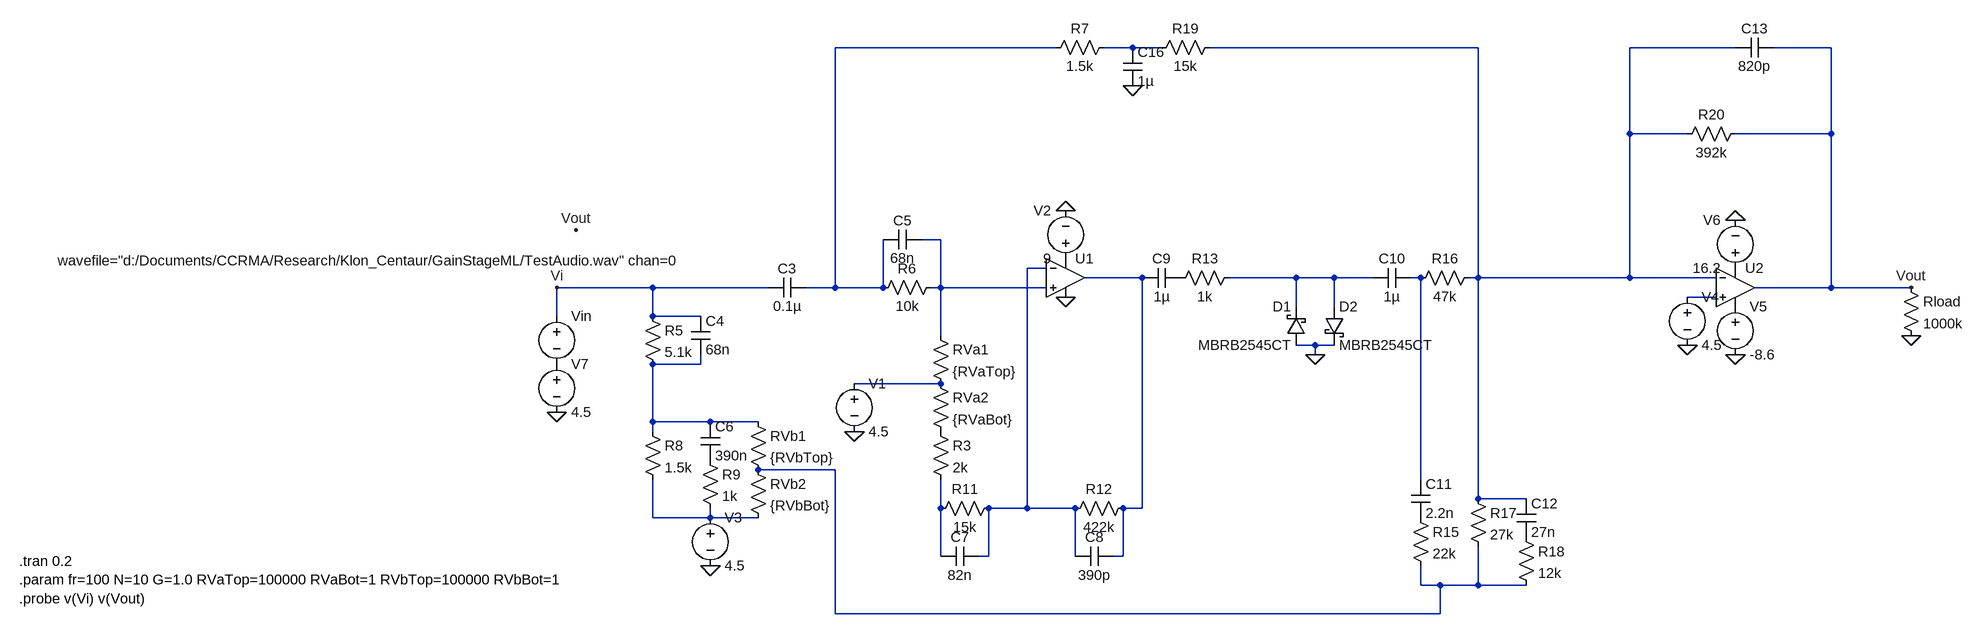
[diagram p0: schematic GainStage2.asc]
GainStage2.asc, the LTspice schematic file:
Version 4
SHEET 1 2608 680
WIRE 800 -304 432 -304
WIRE 928 -304 880 -304
WIRE 976 -304 928 -304
WIRE 1504 -304 1056 -304
WIRE 2144 -304 1968 -304
WIRE 2304 -304 2208 -304
WIRE 1968 -160 1968 -304
WIRE 2064 -160 1968 -160
WIRE 2304 -160 2304 -304
WIRE 2304 -160 2144 -160
WIRE 608 16 576 16
WIRE 784 64 752 64
WIRE 944 80 848 80
WIRE 1200 80 1088 80
WIRE 1264 80 1200 80
WIRE 1328 80 1264 80
WIRE 1408 80 1392 80
WIRE 1504 80 1504 -304
WIRE 1504 80 1488 80
WIRE 1968 80 1968 -160
WIRE 1968 80 1504 80
WIRE 2112 80 1968 80
WIRE 128 96 -32 96
WIRE 320 96 128 96
WIRE 432 96 432 -304
WIRE 432 96 384 96
WIRE 512 96 512 16
WIRE 512 96 432 96
WIRE 608 96 608 16
WIRE 608 96 592 96
WIRE 784 96 608 96
WIRE 2304 96 2304 -160
WIRE 2304 96 2176 96
WIRE 2512 96 2304 96
WIRE 2112 112 2064 112
WIRE 1200 128 1200 80
WIRE 1264 128 1264 80
WIRE -32 144 -32 96
WIRE 128 144 128 96
WIRE 208 144 128 144
WIRE 608 176 608 96
WIRE 1232 192 1200 192
WIRE 1264 192 1232 192
WIRE 1232 208 1232 192
WIRE 208 224 208 208
WIRE 208 224 128 224
WIRE 608 256 464 256
WIRE 128 320 128 224
WIRE 224 320 128 320
WIRE 304 320 224 320
WIRE 128 336 128 320
WIRE 432 400 304 400
WIRE 1408 416 1408 80
WIRE 1504 448 1504 80
WIRE 1584 448 1504 448
WIRE 608 464 608 416
WIRE 752 464 752 64
WIRE 752 464 688 464
WIRE 832 464 752 464
WIRE 944 464 944 80
WIRE 944 464 912 464
WIRE 128 480 128 416
WIRE 224 480 224 464
WIRE 224 480 128 480
WIRE 304 480 224 480
WIRE 608 544 608 464
WIRE 688 544 688 464
WIRE 688 544 672 544
WIRE 832 544 832 464
WIRE 912 544 912 464
WIRE 912 544 896 544
WIRE 1408 592 1408 560
WIRE 1440 592 1408 592
WIRE 1504 592 1504 528
WIRE 1504 592 1440 592
WIRE 1584 592 1504 592
WIRE 432 640 432 400
WIRE 1440 640 1440 592
WIRE 1440 640 432 640
FLAG -32 96 Vi
FLAG 464 336 0
FLAG 816 112 0
FLAG 816 -32 0
FLAG 1232 208 0
FLAG 224 560 0
FLAG 928 -240 0
FLAG 2064 192 0
FLAG 2144 208 0
FLAG 2144 -16 0
FLAG 2512 176 0
FLAG 2512 96 Vout
FLAG 0 0 Vout
FLAG -32 304 0
SYMBOL voltage -32 128 R0
WINDOW 3 -832 -77 Left 2
WINDOW 123 0 0 Left 0
WINDOW 39 0 0 Left 0
SYMATTR Value wavefile="d:/Documents/CCRMA/Research/Klon_Centaur/GainStageML/TestAudio.wav" chan=0
SYMATTR InstName Vin
SYMBOL res 112 128 R0
SYMATTR InstName R5
SYMATTR Value 5.1k
SYMBOL cap 192 144 R0
SYMATTR InstName C4
SYMATTR Value 68n
SYMBOL cap 384 80 R90
WINDOW 0 0 32 VBottom 2
WINDOW 3 32 32 VTop 2
SYMATTR InstName C3
SYMATTR Value 0.1µ
SYMBOL res 608 80 R90
WINDOW 0 0 56 VBottom 2
WINDOW 3 32 56 VTop 2
SYMATTR InstName R6
SYMATTR Value 10k
SYMBOL cap 576 0 R90
WINDOW 0 0 32 VBottom 2
WINDOW 3 32 32 VTop 2
SYMATTR InstName C5
SYMATTR Value 68n
SYMBOL res 592 160 R0
SYMATTR InstName RVa1
SYMATTR Value {RVaTop}
SYMBOL res 592 240 R0
SYMATTR InstName RVa2
SYMATTR Value {RVaBot}
SYMBOL res 592 320 R0
SYMATTR InstName R3
SYMATTR Value 2k
SYMBOL voltage 464 240 R0
WINDOW 123 0 0 Left 0
WINDOW 39 0 0 Left 0
SYMATTR InstName V1
SYMATTR Value 4.5
SYMBOL res 704 448 R90
WINDOW 0 0 56 VBottom 2
WINDOW 3 32 56 VTop 2
SYMATTR InstName R11
SYMATTR Value 15k
SYMBOL cap 672 528 R90
WINDOW 0 0 32 VBottom 2
WINDOW 3 32 32 VTop 2
SYMATTR InstName C7
SYMATTR Value 82n
SYMBOL res 928 448 R90
WINDOW 0 0 56 VBottom 2
WINDOW 3 32 56 VTop 2
SYMATTR InstName R12
SYMATTR Value 422k
SYMBOL cap 896 528 R90
WINDOW 0 0 32 VBottom 2
WINDOW 3 32 32 VTop 2
SYMATTR InstName C8
SYMATTR Value 390p
SYMBOL Opamps\\UniversalOpamp2 816 80 R0
SYMATTR InstName U1
SYMBOL voltage 816 64 R180
WINDOW 0 24 96 Left 2
WINDOW 3 24 16 Left 2
WINDOW 123 0 0 Left 0
WINDOW 39 0 0 Left 0
SYMATTR InstName V2
SYMATTR Value 9
SYMBOL cap 1008 64 R90
WINDOW 0 0 32 VBottom 2
WINDOW 3 32 32 VTop 2
SYMATTR InstName C9
SYMATTR Value 1µ
SYMBOL res 1104 64 R90
WINDOW 0 0 56 VBottom 2
WINDOW 3 32 56 VTop 2
SYMATTR InstName R13
SYMATTR Value 1k
SYMBOL schottky 1216 192 R180
WINDOW 0 24 64 Left 2
WINDOW 3 24 0 Left 2
SYMATTR InstName D1
SYMATTR Value MBRB2545CT
SYMATTR Description Diode
SYMATTR Type diode
SYMBOL schottky 1248 128 R0
SYMATTR InstName D2
SYMATTR Value MBRB2545CT
SYMATTR Description Diode
SYMATTR Type diode
SYMBOL cap 1392 64 R90
WINDOW 0 0 32 VBottom 2
WINDOW 3 32 32 VTop 2
SYMATTR InstName C10
SYMATTR Value 1µ
SYMBOL res 112 320 R0
SYMATTR InstName R8
SYMATTR Value 1.5k
SYMBOL cap 208 320 R0
SYMATTR InstName C6
SYMATTR Value 390n
SYMBOL res 208 368 R0
SYMATTR InstName R9
SYMATTR Value 1k
SYMBOL res 288 304 R0
SYMATTR InstName RVb1
SYMATTR Value {RVbTop}
SYMBOL res 288 384 R0
SYMATTR InstName RVb2
SYMATTR Value {RVbBot}
SYMBOL voltage 224 464 R0
WINDOW 123 0 0 Left 0
WINDOW 39 0 0 Left 0
SYMATTR InstName V3
SYMATTR Value 4.5
SYMBOL res 1392 464 R0
SYMATTR InstName R15
SYMATTR Value 22k
SYMBOL cap 1392 416 R0
SYMATTR InstName C11
SYMATTR Value 2.2n
SYMBOL res 1488 432 R0
SYMATTR InstName R17
SYMATTR Value 27k
SYMBOL res 1568 496 R0
SYMATTR InstName R18
SYMATTR Value 12k
SYMBOL cap 1568 448 R0
SYMATTR InstName C12
SYMATTR Value 27n
SYMBOL res 1504 64 R90
WINDOW 0 0 56 VBottom 2
WINDOW 3 32 56 VTop 2
SYMATTR InstName R16
SYMATTR Value 47k
SYMBOL res 896 -320 R90
WINDOW 0 0 56 VBottom 2
WINDOW 3 32 56 VTop 2
SYMATTR InstName R7
SYMATTR Value 1.5k
SYMBOL res 1072 -320 R90
WINDOW 0 0 56 VBottom 2
WINDOW 3 32 56 VTop 2
SYMATTR InstName R19
SYMATTR Value 15k
SYMBOL cap 912 -304 R0
SYMATTR InstName C16
SYMATTR Value 1µ
SYMBOL Opamps\\UniversalOpamp2 2144 96 R0
SYMATTR InstName U2
SYMBOL voltage 2064 96 R0
WINDOW 123 0 0 Left 0
WINDOW 39 0 0 Left 0
SYMATTR InstName V4
SYMATTR Value 4.5
SYMBOL voltage 2144 112 R0
WINDOW 123 0 0 Left 0
WINDOW 39 0 0 Left 0
SYMATTR InstName V5
SYMATTR Value -8.6
SYMBOL voltage 2144 80 R180
WINDOW 0 24 96 Left 2
WINDOW 3 24 16 Left 2
WINDOW 123 0 0 Left 0
WINDOW 39 0 0 Left 0
SYMATTR InstName V6
SYMATTR Value 16.2
SYMBOL cap 2208 -320 R90
WINDOW 0 0 32 VBottom 2
WINDOW 3 32 32 VTop 2
SYMATTR InstName C13
SYMATTR Value 820p
SYMBOL res 2160 -176 R90
WINDOW 0 0 56 VBottom 2
WINDOW 3 32 56 VTop 2
SYMATTR InstName R20
SYMATTR Value 392k
SYMBOL res 2496 80 R0
SYMATTR InstName Rload
SYMATTR Value 1000k
SYMBOL voltage -32 208 R0
WINDOW 123 0 0 Left 0
WINDOW 39 0 0 Left 0
SYMATTR InstName V7
SYMATTR Value 4.5
TEXT -928 552 Left 2 !.tran 0.2\n.param fr=100 N=10 G=1.0 RVaTop=100000 RVaBot=1 RVbTop=100000 RVbBot=1\n.probe v(Vi) v(Vout)

The netlist it stands for:
* GainStage2.asc
Vin Vi P001 wavefile="d:/Documents/CCRMA/Research/Klon_Centaur/GainStageML/TestAudio.wav" chan=0
R5 Vi N010 5.1k
C4 Vi N010 68n
C3 N001 Vi 0.1µ
R6 N004 N001 10k
C5 N004 N001 68n
RVa1 N004 N011 {RVaTop}
RVa2 N011 P002 {RVaBot}
R3 P002 N013 2k
V1 N011 0 4.5
R11 N005 N013 15k
C7 N005 N013 82n
R12 N006 N005 422k
C8 N006 N005 390p
XU1 N004 N005 P003 0 N006 level.2 Avol=1Meg GBW=10Meg Slew=10Meg ilimit=25m rail=0 Vos=0 phimargin=45 en=0 enk=0 in=0 ink=0 Rin=500Meg  ; pins IN+ IN- V+ V- OUT
V2 P003 0 9
C9 P004 N006 1µ
R13 N007 P004 1k
D1 0 N007 MBRB2545CT
D2 N007 0 MBRB2545CT
C10 N008 N007 1µ
R8 N010 N014 1.5k
C6 N010 P005 390n
R9 P005 N014 1k
RVb1 N010 N012 {RVbTop}
RVb2 N012 N014 {RVbBot}
V3 N014 0 4.5
R15 P006 N012 22k
C11 N008 P006 2.2n
R17 N003 N012 27k
R18 P007 N012 12k
C12 N003 P007 27n
R16 N003 N008 47k
R7 N002 N001 1.5k
R19 N003 N002 15k
C16 N002 0 1µ
XU2 N009 N003 P008 P009 Vout level.2 Avol=1Meg GBW=10Meg Slew=10Meg ilimit=25m rail=0 Vos=0 phimargin=45 en=0 enk=0 in=0 ink=0 Rin=500Meg  ; pins IN+ IN- V+ V- OUT
V4 N009 0 4.5
V5 P009 0 -8.6
V6 P008 0 16.2
C13 Vout N003 820p
R20 Vout N003 392k
Rload Vout 0 1000k
V7 P001 0 4.5
.model D D
.lib standard.dio
.tran 0.2
.param fr=100 N=10 G=1.0 RVaTop=100000 RVaBot=1 RVbTop=100000 RVbBot=1
.probe v(Vi) v(Vout)
.lib UniversalOpamps2.sub
.backanno
.end